# EasyEDA schematic mistygro_easyeda_2023-10-08.json

## Sheets
1 Main: TITLE: Main; REV: 1.0; Date: 2020-12-30; Sheet: 1/1; Drawn By: Myron; Company: Your Company
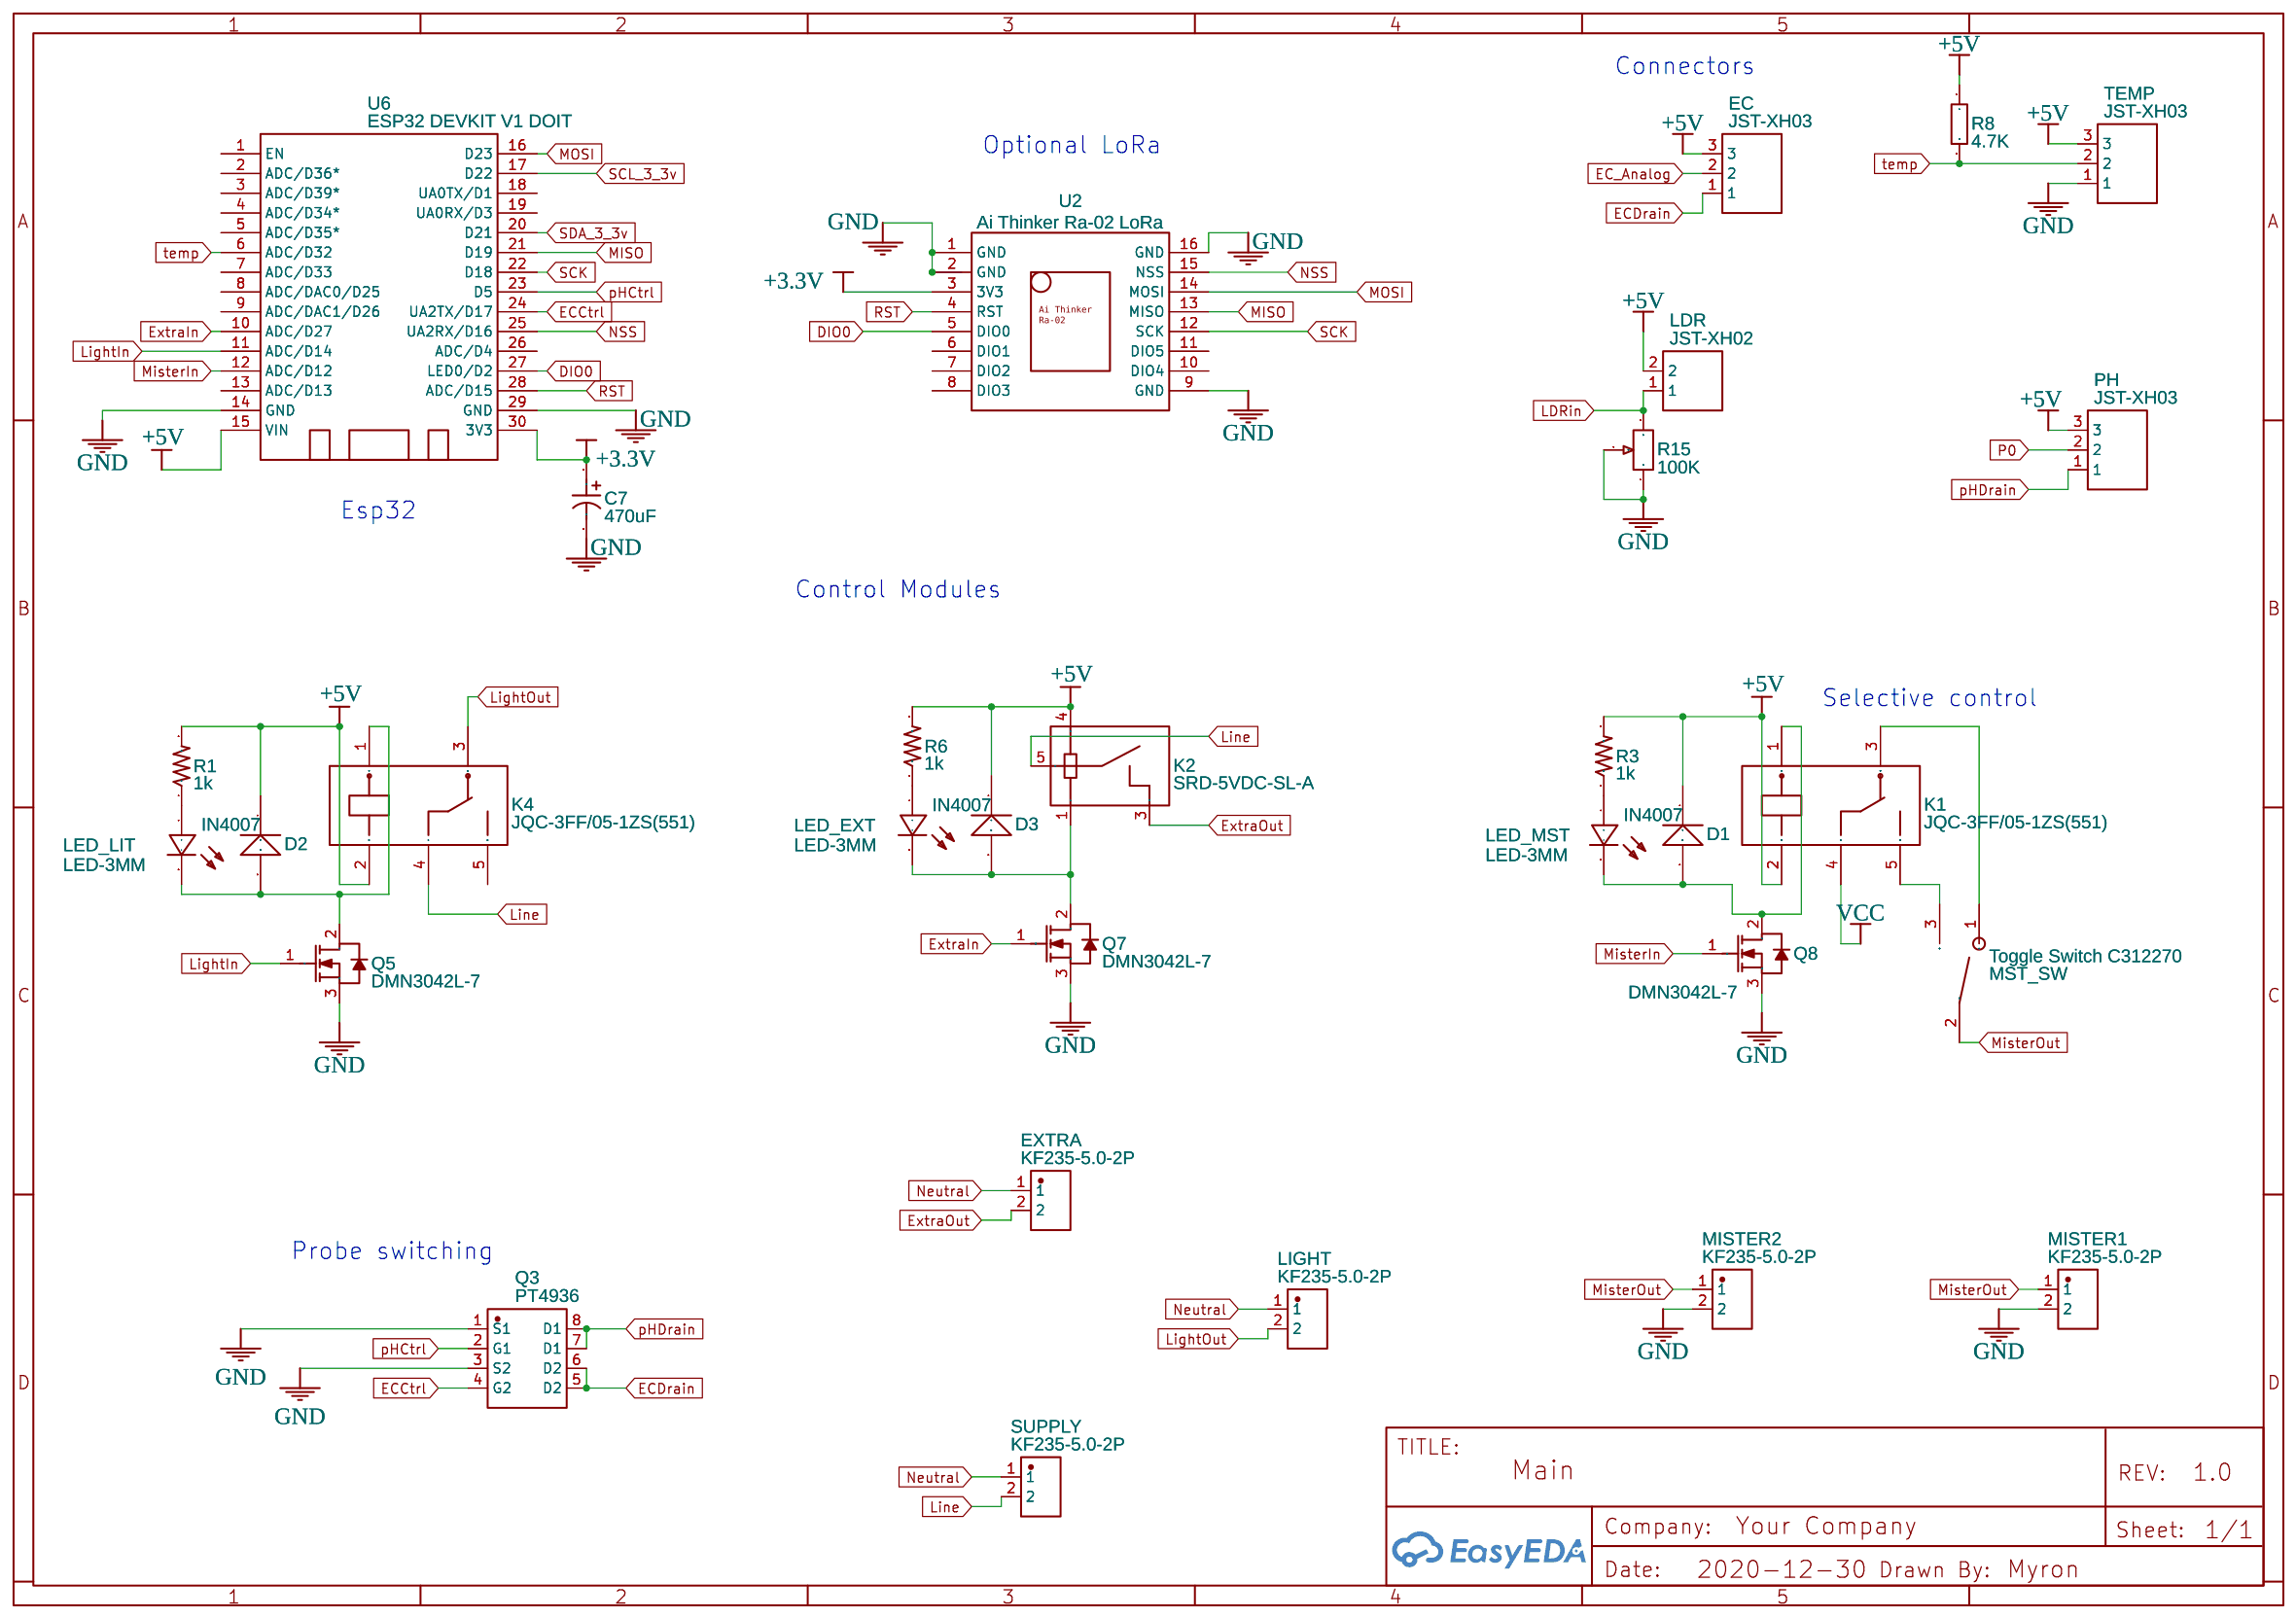
[diagram p0: Main]
2 Power: TITLE: Power; Date: 2021-02-05
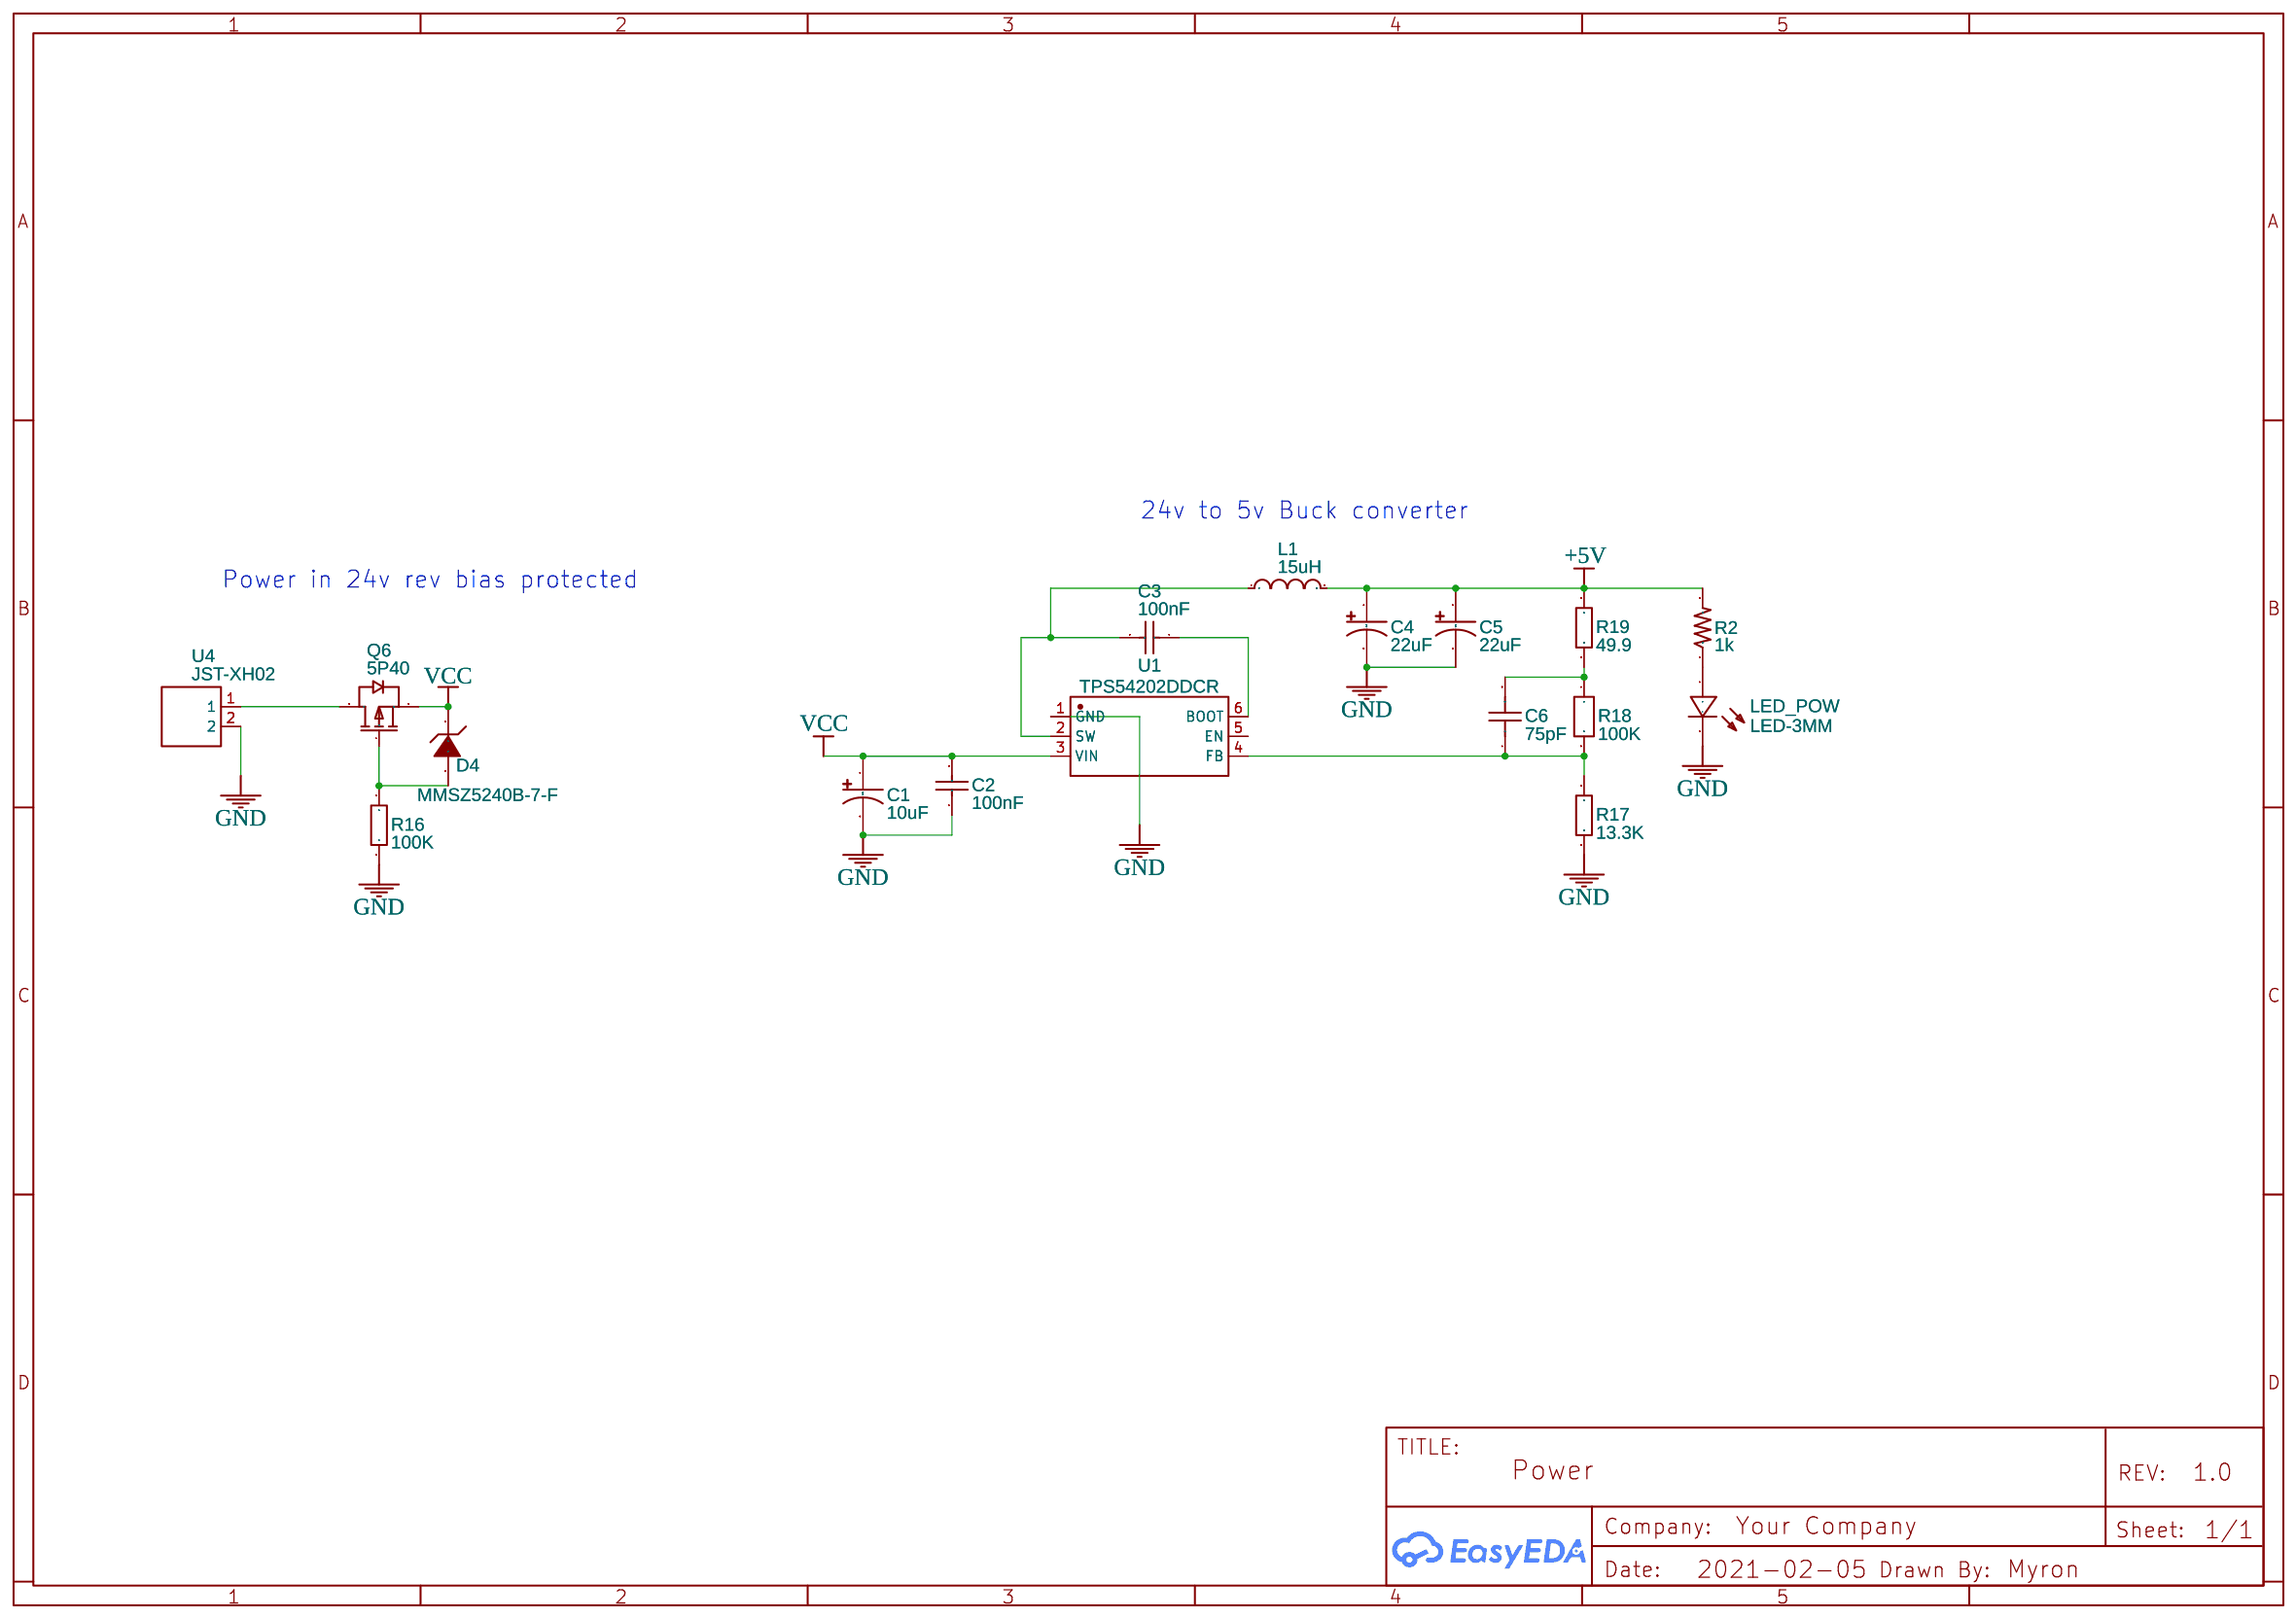
[diagram p1: Power]
3 AnalogI2C: TITLE: AnalogI2C; Date: 2021-04-03
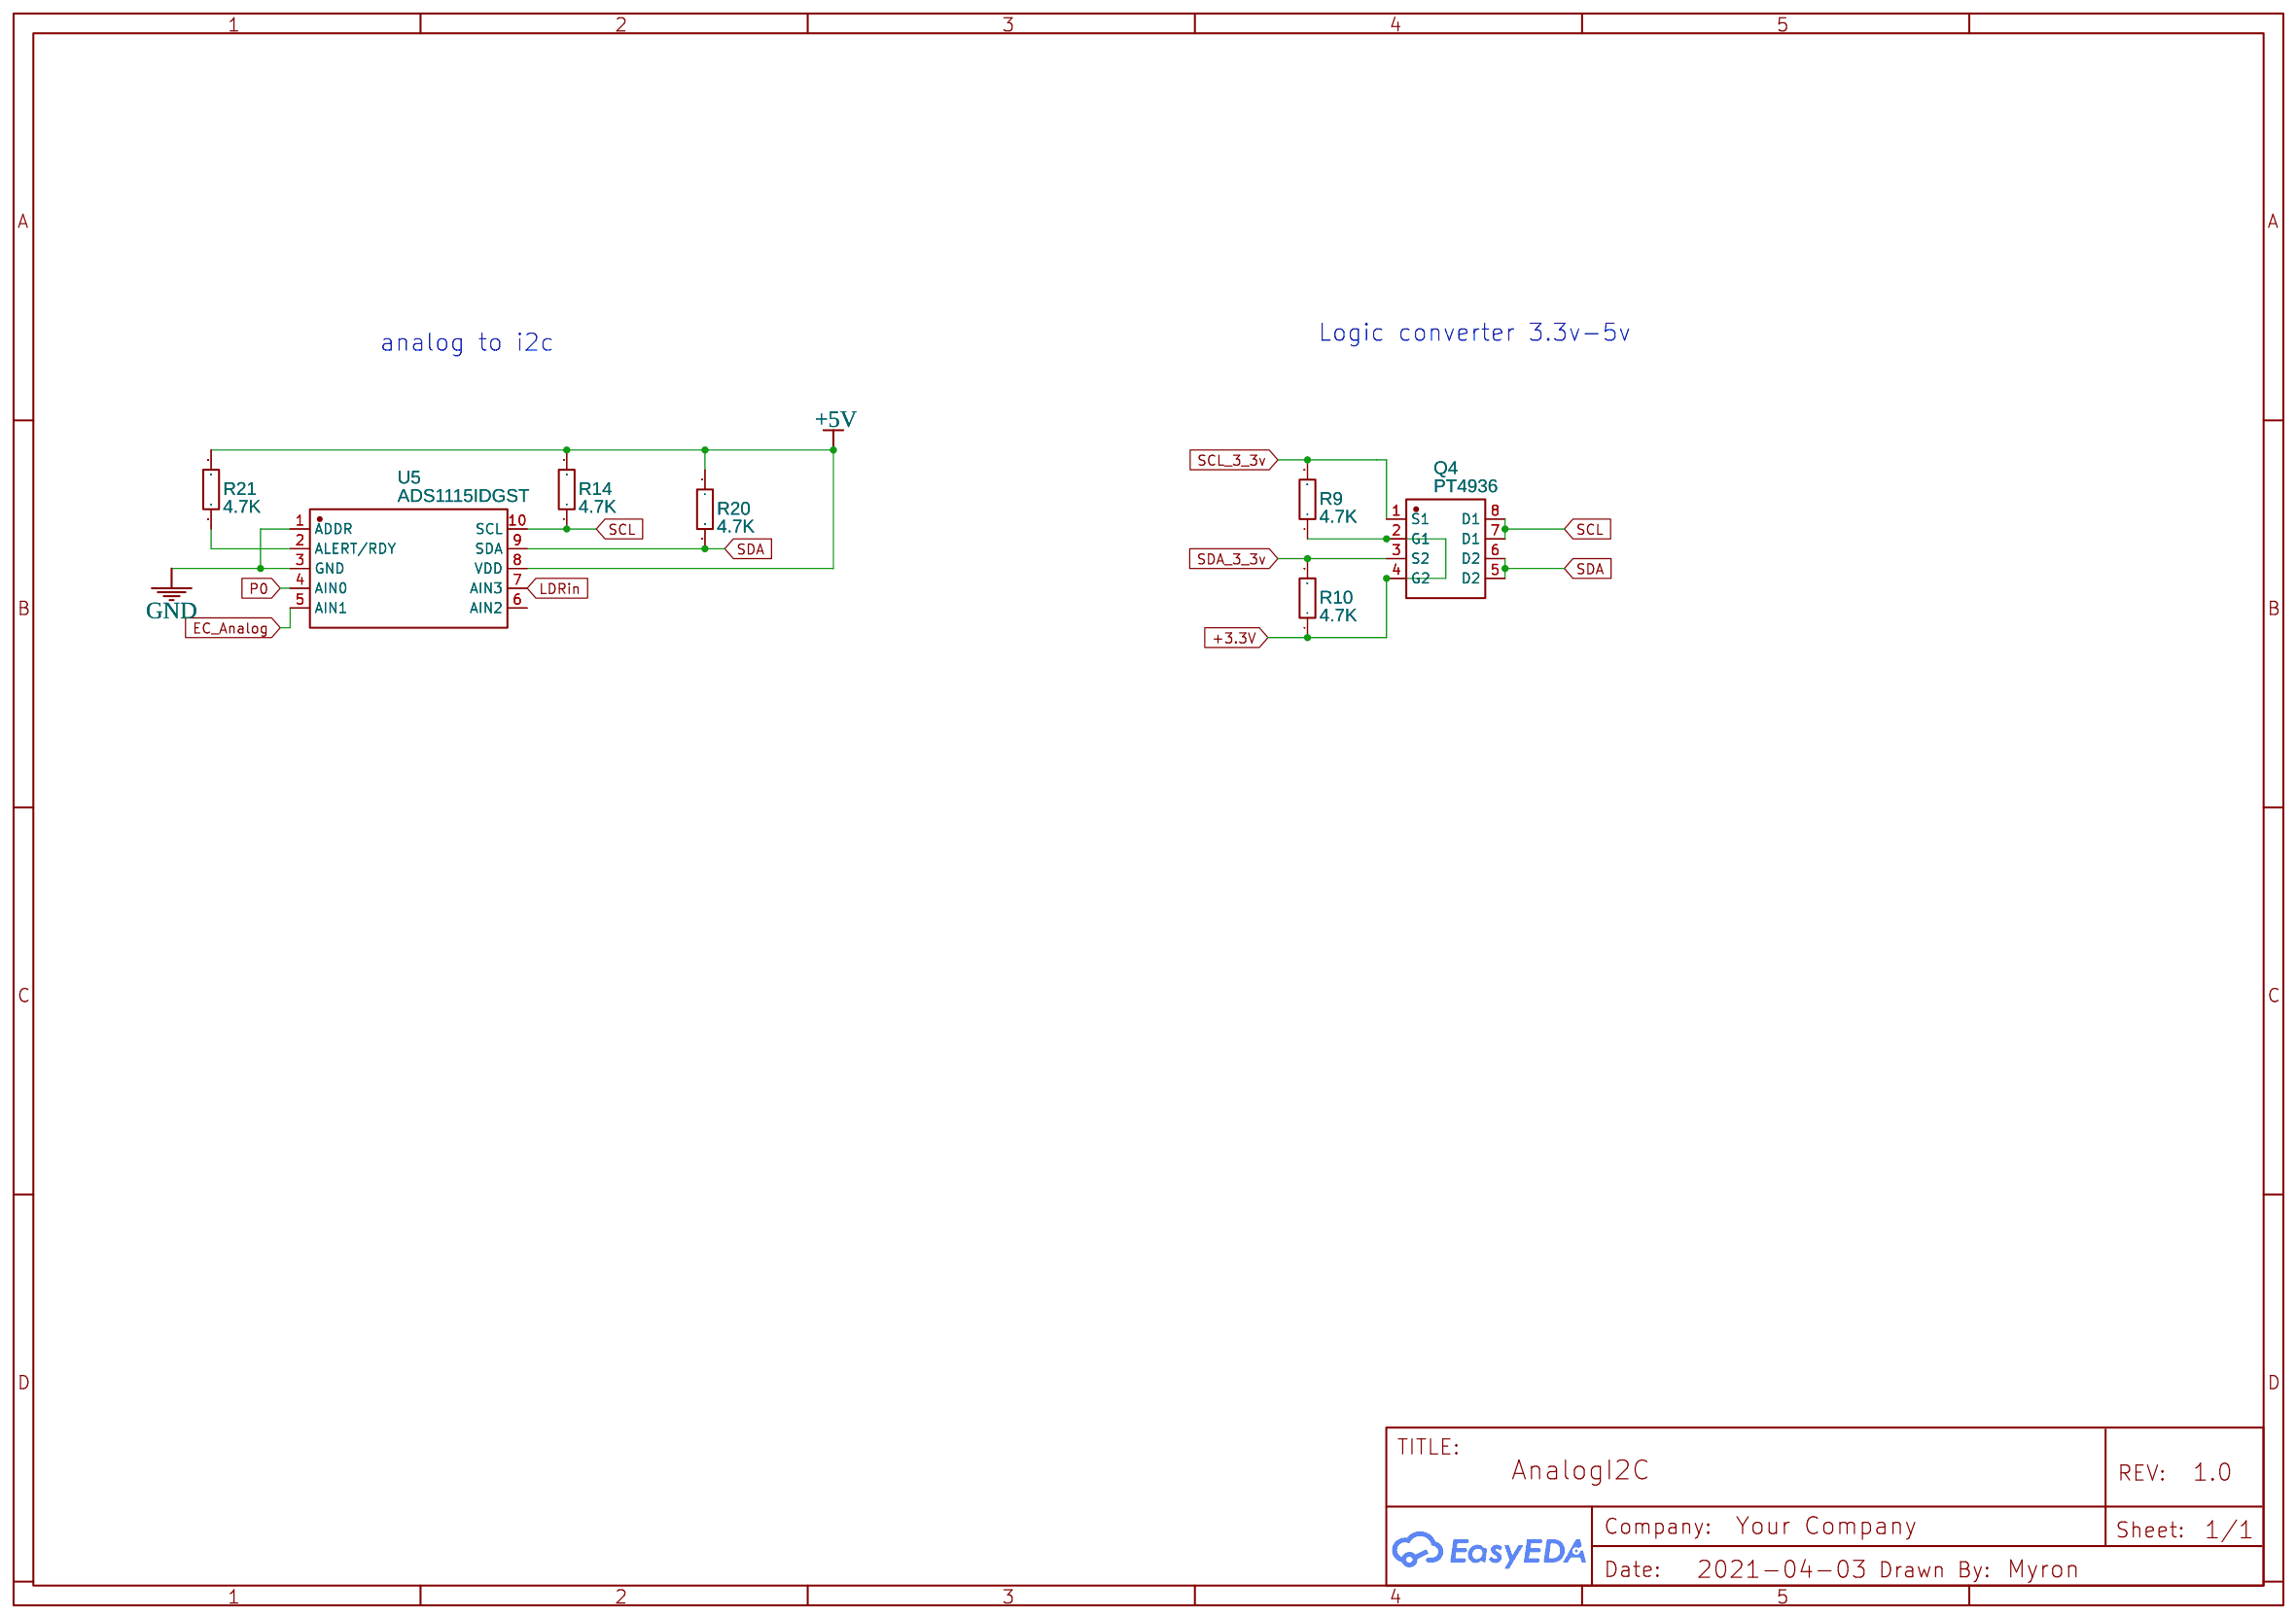
[diagram p2: AnalogI2C]

## Parts
sheet AnalogI2C
Q4  PT4936  [SOIC-8_L5.0-W4.0-P1.27-LS6.0-BL]
R9  4.7K  [R1206]
R10  4.7K  [R1206]
R14  4.7K  [R1206]
R20  4.7K  [R1206]
R21  4.7K  [R1206]
U5  ADS1115IDGST  [VSSOP-10_L3.0-W3.0-P0.50-LS4.9-BL]
sheet Main
C7  470uF  [CAP-SMD_BD6.3-L6.6-W6.6-LS7.6-RD]
D1  IN4007  [IN4007]
D2  IN4007  [IN4007]
D3  IN4007  [IN4007]
EC  JST-XH03  [JST-XH03]
EXTRA  KF235-5.0-2P  [CONN-TH_P5.00_KF235-5.0-2P]
K1  JQC-3FF/05-1ZS(551)  [RELAY-TH_HF3FF-XX-1ZXX-XXX]
K2  SRD-5VDC-SL-A  [SRD-5VDC-SL-A]
K4  JQC-3FF/05-1ZS(551)  [RELAY-TH_HF3FF-XX-1ZXX-XXX]
LDR  JST-XH02  [JST-XH02]
LED_EXT  LED-3MM  [LED-3MM/2.54]
LED_LIT  LED-3MM  [LED-3MM/2.54]
LED_MST  LED-3MM  [LED-3MM/2.54]
LIGHT  KF235-5.0-2P  [CONN-TH_P5.00_KF235-5.0-2P]
MISTER1  KF235-5.0-2P  [CONN-TH_P5.00_KF235-5.0-2P]
MISTER2  KF235-5.0-2P  [CONN-TH_P5.00_KF235-5.0-2P]
MST_SW  Toggle Switch C312270  [TOGGLE SWITCH C312270]
PH  JST-XH03  [JST-XH03]
Q3  PT4936  [SOIC-8_L5.0-W4.0-P1.27-LS6.0-BL]
Q5  DMN3042L-7  [SOT-23-3_L2.9-W1.6-P1.90-LS2.8-BR-CW]
Q7  DMN3042L-7  [SOT-23-3_L2.9-W1.6-P1.90-LS2.8-BR-CW]
Q8  DMN3042L-7  [SOT-23-3_L2.9-W1.6-P1.90-LS2.8-BR-CW]
R1  1k  [1206]
R3  1k  [1206]
R6  1k  [1206]
R8  4.7K  [R1206]
R15  100K  [RES-ADJ-TH_3P-L9.5-W4.9-P2.50-L_3296W]
SUPPLY  KF235-5.0-2P  [CONN-TH_P5.00_KF235-5.0-2P]
TEMP  JST-XH03  [JST-XH03]
U2  Ai Thinker Ra-02 LoRa  [AI THINKER RA-02 LORA]
U6  ESP32 DEVKIT V1 DOIT  [DOIT-ESP32-DEVKIT-V1]
sheet Power
C1  10uF  [CAP-SMD_BD5.0-L5.3-W5.3-FD]
C2  100nF  [C1206]
C3  100nF  [C1206]
C4  22uF  [CAP-SMD_BD6.3-L6.6-W6.6-FD]
C5  22uF  [CAP-SMD_BD6.3-L6.6-W6.6-FD]
C6  75pF  [C0805]
D4  MMSZ5240B-7-F  [SOD-123_L2.7-W1.6-LS3.7-RD]
L1  15uH  [IND-SMD_L5.0-W5.0_SWPA5040S]
LED_POW  LED-3MM  [LED-3MM/2.54]
Q6  5P40  [SOT-23-3_L2.9-W1.6-P1.90-LS2.8-BR]
R2  1k  [1206]
R16  100K  [R1206]
R17  13.3K  [R1206]
R18  100K  [R1206]
R19  49.9  [R0805]
U1  TPS54202DDCR  [SOT-23-6_L2.9-W1.6-P0.95-LS2.8-BR]
U4  JST-XH02  [JST-XH02]

## Library data of the parts
Q3 Q4 = PT4936: Supplier: LCSC; Supplier Part: C479040; Manufacturer: PUOLOP; Contributor: LCSC
R8-R10 R14 R20 R21 = CRCW12064K70FKEA: Supplier: LCSC; Supplier Part: C242482; Manufacturer: Vishay Intertech; Contributor: LCSC
U5 = ADS1115IDGST: Supplier: LCSC; Supplier Part: C468683; Manufacturer: Texas Instruments; Contributor: LCSC; SMT Type: Extend; JLCPCB SMD: Yes; LCSC Assembly: Yes; Paste Type: expand
C7 = RVT1C471M0607: Contributor: lcsc; Supplier: LCSC; Supplier Part: C2977552; Manufacturer: ROQANG(容强); JLCPCB Part Class: Extended Part; link: https://lcsc.com/eda_search?q=C2977552&%26type=1&ref=editor
D1-D3 = -: Manufacturer Part: IRFD9120PbF; Contributor: William Meade
EC PH TEMP = JST-XH03: Contributor: laurent66
EXTRA LIGHT MISTER1 MISTER2 SUPPLY = KF235-5.0-2P: Supplier: LCSC; Supplier Part: C475172; Manufacturer: Cixi Kefa Elec; Contributor: LCSC
K1 K4 = JQC-3FF/05-1ZS(551): Supplier: LCSC; Manufacturer: HF(宏发); Manufacturer Part: JQC-3FF/005-1ZS(551); Supplier Part: C9221; JLCPCB Part Class: Extended Part
K2 = -: Supplier: LCSC; Supplier Part: C140615; Manufacturer: Ningbo Songle Relay; Contributor: LCSC
LDR U4 = JST-XH02: Contributor: laurent66
LED_EXT LED_LIT LED_MST LED_POW = -: Supplier: LCSC; Manufacturer: EVERLIGHT; Manufacturer Part: 204-10SURD/S530-A3; Supplier Part: C99772
MST_SW = Toggle Switch C312270: Manufacturer: YUEN FUNG; Manufacturer Part: ST-1-102-A01-T000-RS; Supplier: LCSC; Supplier Part: C312270; link: https://lcsc.com/product-detail/Toggle-Switches_YUEN-FUNG-ST-1-102-A01-T000-RS_C312270.html; Contributor: danielbland
Q5 Q7 Q8 = DMN3042L-7: Supplier: LCSC; Supplier Part: C102621; Manufacturer: Diodes Incorporated; Contributor: LCSC; SMT Type: Extend; JLCPCB SMD: Yes; LCSC Assembly: Yes
R1-R3 R6 = -: Contributor: SparkFun; Manufacturer Part: ?
R15 = 3296W-1-104: Supplier: LCSC; Supplier Part: C118963; Manufacturer: Chengdu Guosheng Tech; Contributor: LCSC; LCSC Assembly: Yes; SMT Type: Extend
U2 = Ai Thinker Ra-02 LoRa: Contributor: Fritz Keyzer
U6 = ESP32 DEVKIT V1 DOIT: Contributor: ConceitoTeam
C1 = EEEHB1V100AR: Supplier: LCSC; Supplier Part: C336504; Manufacturer: PANASONIC; Contributor: LCSC
C2 C3 = CL31B104KBCNNNC: Supplier: LCSC; Manufacturer: SAMSUNG; Supplier Part: C24497; SMT Type: Basic; JLCPCB SMD: Yes; LCSC Assembly: Yes
C4 C5 = CK1V220M-CRE54: Supplier: LCSC; Supplier Part: C190079; Manufacturer: Semtech; Contributor: LCSC
C6 = CC0805JRNPO9BN750: Supplier: LCSC; Supplier Part: C113832; Manufacturer: YAGEO; Contributor: LCSC
D4 = MMSZ5240B-7-F: Supplier: LCSC; Manufacturer: DIODES; Contributor: LCSC; Supplier Part: C151060; SMT Type: Extend; JLCPCB SMD: Yes; LCSC Assembly: Yes
L1 = CR5040-150M: Supplier: LCSC; Supplier Part: C520353; Manufacturer: Ceaiya; Contributor: LCSC
Q6 = 5P40: Supplier: LCSC; Supplier Part: C239051; Manufacturer: GOFORD; Contributor: LCSC; SMT Type: Extend; JLCPCB SMD: Yes; LCSC Assembly: Yes
R16 = AR06FTCV1003: Supplier: LCSC; Supplier Part: C412413; Manufacturer: Viking Tech; Contributor: LCSC
R17 = TR1206B13K3P0550: Supplier: LCSC; Supplier Part: C153316; Manufacturer: Ever Ohms Tech; Contributor: LCSC
R18 = TC0650F1003T5E: Supplier: LCSC; Supplier Part: C425571; Manufacturer: UNI-ROYAL(Uniroyal Elec); Contributor: LCSC
R19 = TC0525F499JT5E: Supplier: LCSC; Manufacturer: UniOhm; Supplier Part: C78599; SMT Type: Extend; JLCPCB SMD: Yes; LCSC Assembly: Yes
U1 = TPS54202DDCR: Supplier: LCSC; Supplier Part: C191884; Manufacturer: Texas Instruments; Contributor: LCSC; SMT Type: Extend; JLCPCB SMD: Yes; LCSC Assembly: Yes

## Nets
+3.3V: C7.1 Q4.2(G1) Q4.4(G2) R9.1 R10.1 U2.3(3V3) U6.30(3V3)
+5V: C4.1 C5.1 D1.1 D2.1 D3.1 EC.3 K1.2 K2.4 K4.2 L1.2 LDR.2 PH.3 R1.2 R2.2 R3.2 R6.2 R8.1 R14.2 R19.1 R20.1 R21.2 TEMP.3 U5.8(VDD) U6.15(VIN)
GND: C1.2 C2.2 C4.2 C5.2 C7.2 LED_POW.2(-) MISTER1.2 MISTER2.2 Q3.1(S1) Q3.3(S2) Q5.3(S) Q7.3(S) Q8.3(S) R15.1 R15.2 R16.1 R17.2 TEMP.1 U1.1(GND) U2.1(GND) U2.2(GND) U2.9(GND) U2.16(GND) U4.2 U5.1(ADDR) U5.3(GND) U6.14(GND) U6.29(GND)
VCC: C1.1 C2.1 D4.1(K) K1.4 Q6.2(S) U1.3(VIN)
DIO0: U2.5(DIO0) U6.27(LED0/D2)
EC_Analog: EC.2 U5.5(AIN1)
ECCtrl: Q3.4(G2) U6.24(UA2TX/D17)
ECDrain: EC.1 Q3.5(D2) Q3.6(D2)
ExtraIn: Q7.1(G) U6.10(ADC/D27)
ExtraOut: EXTRA.2 K2.3
LDRin: LDR.1 R15.3 U5.7(AIN3)
LightIn: Q5.1(G) U6.11(ADC/D14)
LightOut: K4.3 LIGHT.2
Line: K2.5 K4.4 SUPPLY.2
MISO: U2.13(MISO) U6.21(D19)
MisterIn: Q8.1(G) U6.12(ADC/D12)
MisterOut: MISTER1.1 MISTER2.1 MST_SW.2
MOSI: U2.14(MOSI) U6.16(D23)
Neutral: EXTRA.1 LIGHT.1 SUPPLY.1
NSS: U2.15(NSS) U6.25(UA2RX/D16)
P0: PH.2 U5.4(AIN0)
pHCtrl: Q3.2(G1) U6.23(D5)
pHDrain: PH.1 Q3.7(D1) Q3.8(D1)
RST: U2.4(RST) U6.28(ADC/D15)
SCK: U2.12(SCK) U6.22(D18)
SCL: Q4.7(D1) Q4.8(D1) R14.1 U5.10(SCL)
SCL_3_3v: Q4.1(S1) R9.2 U6.17(D22)
SDA: Q4.5(D2) Q4.6(D2) R20.2 U5.9(SDA)
SDA_3_3v: Q4.3(S2) R10.2 U6.20(D21)
temp: R8.2 TEMP.2 U6.6(ADC/D32)
Net-(C3-1): C3.1 U1.6(BOOT)
Net-(C3-2): C3.2 L1.1 U1.2(SW)
Net-(C6-1): C6.1 R17.1 R18.2 U1.4(FB)
Net-(C6-2): C6.2 R18.1 R19.2
Net-(D1-2): D1.2 K1.1 LED_MST.2(-) Q8.2(D)
Net-(D2-2): D2.2 K4.1 LED_LIT.2(-) Q5.2(D)
Net-(D3-2): D3.2 K2.1 LED_EXT.2(-) Q7.2(D)
Net-(D4-2): D4.2(A) Q6.1(G) R16.2
Net-(K1-3): K1.3 MST_SW.1
Net-(K1-5): K1.5 MST_SW.3
Net-(LED_EXT-1): LED_EXT.1(+) R6.1
Net-(LED_LIT-1): LED_LIT.1(+) R1.1
Net-(LED_MST-1): LED_MST.1(+) R3.1
Net-(LED_POW-1): LED_POW.1(+) R2.1
Net-(Q6-3): Q6.3(D) U4.1
Net-(R21-1): R21.1 U5.2(ALERT/RDY)

Not connected (* = marked no-connect by the designer): K4 5; U1 5(EN); U2 6(DIO1) 7(DIO2) 8(DIO3) 10(DIO4) 11(DIO5); U5 6(AIN2); U6 1(EN) 2(ADC/D36*) 3(ADC/D39*) 4(ADC/D34*) 5(ADC/D35*) 7(ADC/D33) 8(ADC/DAC0/D25) 9(ADC/DAC1/D26) 13(ADC/D13) 18(UA0TX/D1) 19(UA0RX/D3) 26(ADC/D4)

## Notes on the sheets
sheet 1
- Connectors
- Optional LoRa
- Esp32
- Control Modules
- Selective control
- Probe switching
sheet 2
- 24v to 5v Buck converter
- Power in 24v rev bias protected
sheet 3
- Logic converter 3.3v-5v
- analog to i2c
